# EAGLE design mux-shield-pcb (EAGLE 7.3.0)
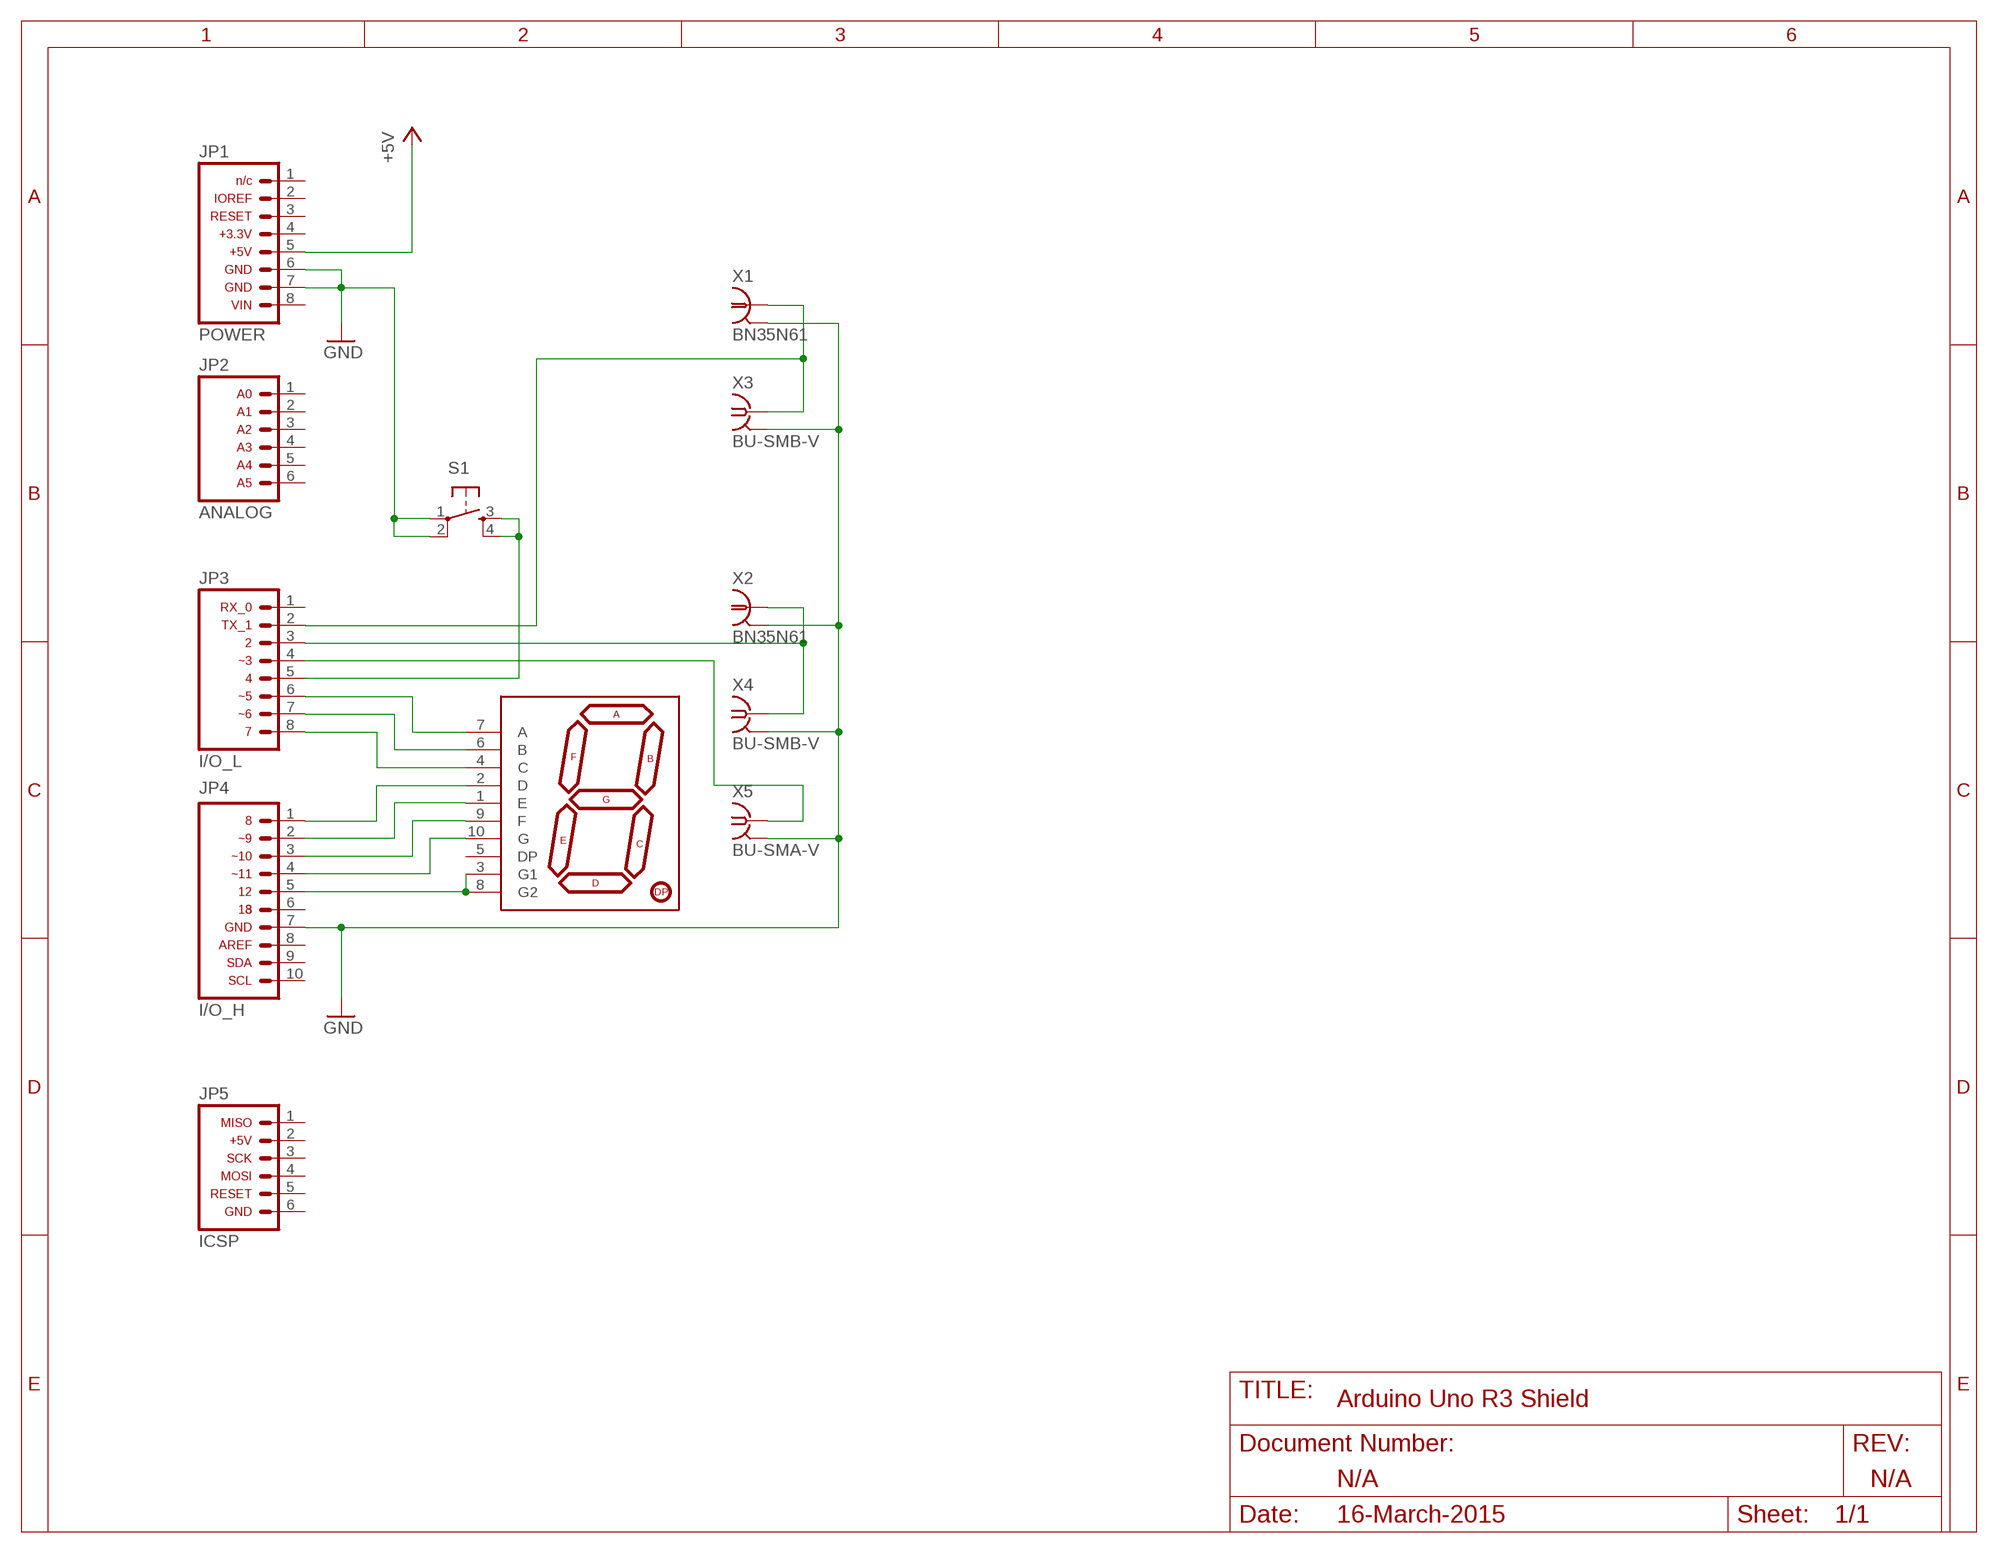
[diagram p0: schematic, sheet 1]

## Parts
JP1  ARDUINO_CONN-POWERSIP  [CONN-1X08]
JP2  ARDUINO_CONN-ANALOGSIP  [CONN-1X06]
JP3  ARDUINO_CONN-IO_LSIP  [CONN-1X08]
JP4  ARDUINO_CONN-IO_HSIP  [CONN-1X10]
JP5  ARDUINO_CONN-ICSP  [CONN-2X03]
S1  TAC_SWITCHPTH  [TACTILE-PTH]
U$1  7-SEGMENT-DISPLAY-1"-RED  [7-SEGMENT-1"PTH]
X1  BN35N61  [B35N61]
X2  BN35N61  [B35N61]
X3  BU-SMB-V  [BU-SMB-V]
X4  BU-SMB-V  [BU-SMB-V]
X5  BU-SMA-V  [BU-SMA-V]

## Nets
+5V: JP1.5
GND: JP1.6 JP1.7 JP4.7 S1.1 S1.2 X1.2 X1.3 X1.4 X1.5 X2.2 X2.3 X2.4 X2.5 X3.2 X3.3 X3.4 X3.5 X4.2 X4.3 X4.4 X4.5 X5.2 X5.3 X5.4 X5.5
N$1: JP3.2 X1.1 X3.1
N$2: JP3.4 X5.1
N$3: JP3.3 X2.1 X4.1
N$4: JP3.5 S1.3 S1.4
N$5: JP4.5 U$1.3(G1) U$1.8(G2)
N$6: JP3.6 U$1.7(A)
N$7: JP3.7 U$1.6(B)
N$8: JP3.8 U$1.4(C)
N$9: JP4.1 U$1.2(D)
N$10: JP4.2 U$1.1(E)
N$11: JP4.3 U$1.9(F)
N$12: JP4.4 U$1.10(G)
Unconnected: JP1.1 JP1.2 JP1.3 JP1.4 JP1.8 JP2.1 JP2.2 JP2.3 JP2.4 JP2.5 JP2.6 JP3.1 JP4.6 JP4.8 JP4.9 JP4.10 JP5.1 JP5.2 JP5.3 JP5.4 JP5.5 JP5.6 U$1.5(DP)

## Library data of the parts
JP1 = _Jim:ARDUINO_CONN-POWER: Arduino Power Header
JP2 = _Jim:ARDUINO_CONN-ANALOG: Arduino Analog I/O Header
JP3 = _Jim:ARDUINO_CONN-IO_L: Arduino Digital I/O [Low Byte] Header
JP4 = _Jim:ARDUINO_CONN-IO_H: Arduino Digital I/O [High Byte] Header
JP5 = _Jim:ARDUINO_CONN-ICSP: Header 6
S1 = SparkFun-Retired:TAC_SWITCH: Momentary Switch Button commonly used for reset or general input. Spark Fun Electronics SKU : COM-00097 SMT- SWCH-08247
U$1 = SparkFun-Displays:7-SEGMENT-DISPLAY-1"-RED: 7-Segment Display 1" Red (COM-08546) EZ is for kits. Pads are only exposed on the bottom side to help prevent soldering in upside down.
X1 X2 = con-coax:BN35N61: BNC CONNECTOR M/A COM www.macom.com distributor Farnell 149-452; OC_FARNELL: unknown; OC_NEWARK: unknown
X3 X4 = con-coax:BU-SMB-V: FEMALE SMB CONNECTOR Radiall distributor RS 112-2993; OC_FARNELL: unknown; OC_NEWARK: unknown
X5 = con-coax:BU-SMA-V: FEMALE SMA CONNECTOR Radiall distributor RS 112-3794; OC_FARNELL: unknown; OC_NEWARK: unknown

## Board
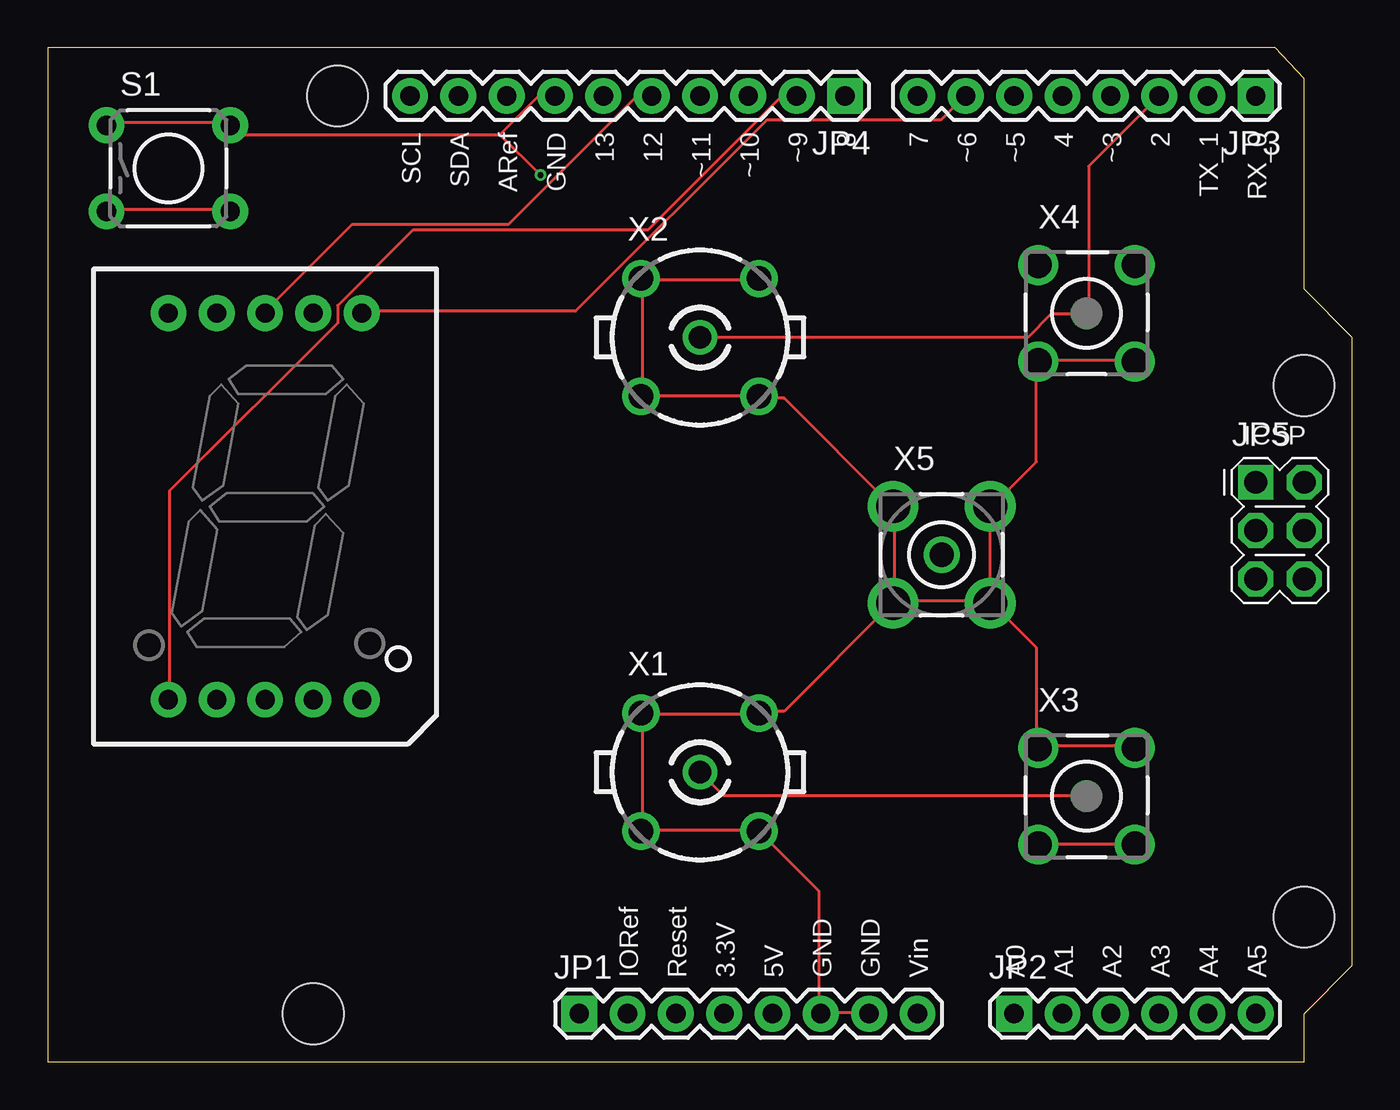
[diagram p1: board, top side]
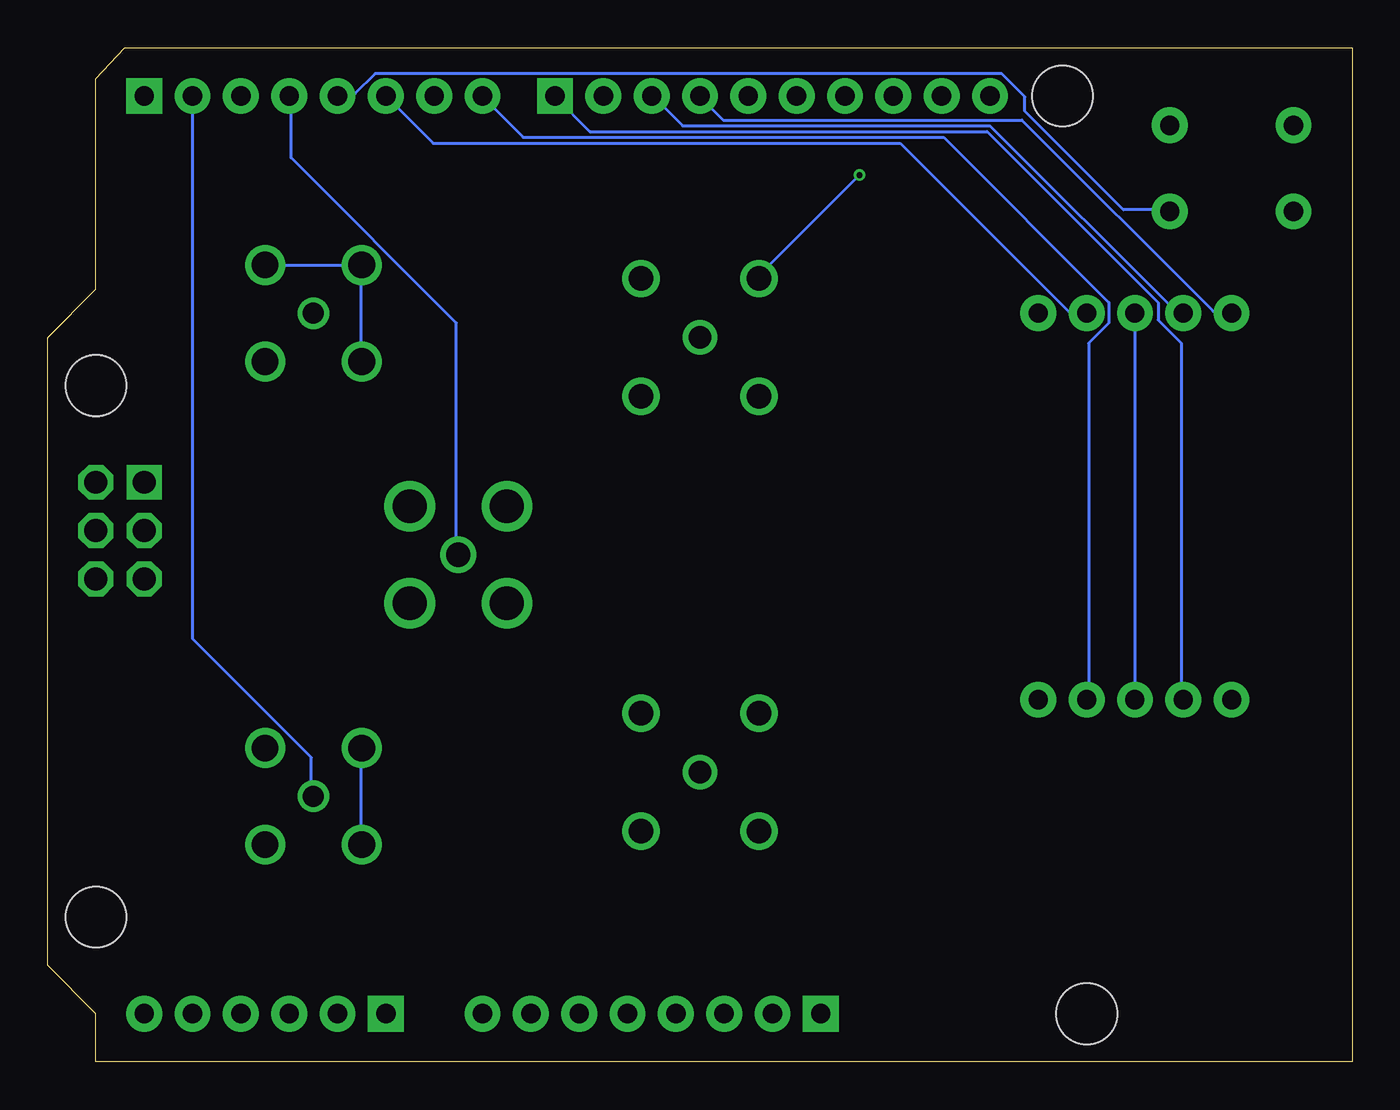
[diagram p2: board, bottom side, seen from below]

Size 68.58 x 53.34 mm. Coordinates in mm from the lower left corner, seen from the top.
Outline: 0,0 66.04,0 66.04,2.54 68.58,5.08 68.58,38.1 66.04,40.64 66.04,51.69 64.52,53.34 0,53.34 0,0
Copper layers (1*16): Top 0.035mm / dielectric 1.5mm / Bottom 0.035mm
Design rules "SeeedStudio_2layer_DRU_no_angle_20140221": minimum track width 6mil, minimum drill 12mil, track to track 6mil, track to pad 6mil, pad to pad 6mil, via to via 6mil, smd to smd 0mil, copper to edge 10mil, drill to drill 10mil, minimum pad ring 10mil, minimum via ring 6mil, stop-mask expansion 2mil, vias tented up to drill 100mil, thermal gap 10mil
Holes 3.2 mm at 15.24,50.8 66.04,35.56 66.04,7.62 13.97,2.54

### Footprints (pad centres in the part's own frame; a part is rotated, then mirrored left to right if it is on the bottom)
CONN-1X08 = drill 1.016 pad 1.88 square: 1 0,0 | drill 1.016 pad 1.88: 2 2.54,0; 3 5.08,0; 4 7.62,0; 5 10.16,0; 6 12.7,0; 7 15.24,0; 8 17.78,0
CONN-1X06 = drill 1.016 pad 1.88 square: 1 0,0 | drill 1.016 pad 1.88: 2 2.54,0; 3 5.08,0; 4 7.62,0; 5 10.16,0; 6 12.7,0
CONN-1X10 = drill 1.016 pad 1.88 square: 1 0,0 | drill 1.016 pad 1.88: 2 2.54,0; 3 5.08,0; 4 7.62,0; 5 10.16,0; 6 12.7,0; 7 15.24,0; 8 17.78,0; 9 20.32,0; 10 22.86,0
CONN-2X03 = drill 1.2 pad 1.829 square: 1 0,0 | drill 1.2 pad 1.829 octagon: 2 2.54,0; 3 0,-2.54; 4 2.54,-2.54; 5 0,-5.08; 6 2.54,-5.08
TACTILE-PTH = drill 1.016 pad 1.88: 1 -3.251,2.261; 2 3.251,2.261; 3 -3.251,-2.261; 4 3.251,-2.261
7-SEGMENT-1"PTH = drill 1 pad 1.88: 1 -5.08,-10.16; 2 -2.54,-10.16; 3 0,-10.16; 4 2.54,-10.16; 5 5.08,-10.16; 6 5.08,10.16; 7 2.54,10.16; 8 0,10.16; 9 -2.54,10.16; 10 -5.08,10.16
B35N61 = drill 1.2: 1 0,0 | drill 1.3: 2 3.099,3.099; 3 -3.099,3.099; 4 -3.099,-3.099; 5 3.099,-3.099
BU-SMB-V = drill 1.1: 1 0,0 | drill 1.4: 2 -2.54,2.54; 3 2.54,2.54; 4 2.54,-2.54; 5 -2.54,-2.54
BU-SMA-V = drill 1.27: 1 0,0 | drill 1.778: 2 -2.55,2.55; 3 2.55,2.55; 4 2.55,-2.55; 5 -2.55,-2.55

### Placement (x,y rotation side)
JP1  27.94,2.54 0 top
JP2  50.8,2.54 0 top
JP3  63.5,50.8 180 top
JP4  41.91,50.8 180 top
JP5  63.5,30.48 0 top
S1  6.35,46.99 0 top
U$1  11.43,29.21 0 top
X1  34.29,15.24 0 top
X2  34.29,38.1 0 top
X3  54.61,13.97 0 top
X4  54.61,39.37 0 top
X5  46.99,26.67 0 top

### Tracks (layer width: path | path; a pad name or v marks a point on that pad's centre or on a via)
GND  (via drill 0.3)
  Top 0.152: JP1.7 43.13,2.59 40.69,2.59 JP1.6 40.54,2.59 40.54,8.99 X1.5 37.34,12.19 31.24,12.19 | 31.24,18.29 31.24,12.19 | 31.24,12.19 X1.4 | 31.24,18.29 37.34,18.29 X1.2 37.49,18.44 38.71,18.44 44.35,24.08 X5.5 44.5,24.23 | 31.24,18.29 X1.3 | S1.1 3.2,49.38 9.6,49.38 S1.2 9.6,49.23 10.06,48.77 23.77,48.77 | 23.77,48.77 25.76,50.75 26.67,50.75 JP4.7 | 31.24,41.15 31.24,35.05 | 31.24,35.05 37.34,35.05 X2.5 37.49,34.9 38.71,34.9 44.35,29.26 X5.2 44.5,29.11 44.5,24.23 | 31.24,35.05 X2.4 | 31.24,41.15 37.34,41.15 X2.2 | 31.24,41.15 X2.3 | X4.4 57.15,36.88 52.12,36.88 X4.5 51.97,36.73 51.97,31.55 49.68,29.26 X5.3 49.53,29.11 49.53,24.23 | X3.4 X3.5 | X3.3 57.15,16.61 52.12,16.61 X3.2 51.97,16.61 51.97,21.79 49.68,24.08 X5.4 49.53,24.23 | 49.53,24.23 44.5,24.23 | v25.91,46.63 23.77,48.77
  Bottom 0.152: X4.3 52.12,41.91 | 52.12,41.91 52.12,36.88 X4.5 | 52.12,41.91 X4.2 | X3.5 52.12,11.43 52.12,16.46 X3.2 | v25.91,46.63 31.24,41.3 X2.3
N$1
  Top 0.152: X1.1 35.51,14.02 54.56,14.02 X3.1
  Bottom 0.152: JP3.2 60.96,22.25 54.71,16 54.71,14.02 X3.1
N$2
  Bottom 0.152: JP3.4 55.78,50.75 55.78,47.55 47.09,38.86 47.09,26.67 X5.1
N$3
  Top 0.152: JP3.3 54.71,47.09 54.71,39.47 X4.1 54.56,39.32 52.73,39.32 51.51,38.1 X2.1
N$4
  Top 0.152: S1.3 3.2,44.81 9.6,44.81 S1.4
  Bottom 0.152: JP3.5 53.34,50.9 52.43,50.9 51.36,51.97 18.44,51.97 17.22,50.75 17.22,49.99 12.04,44.81 9.6,44.81 S1.4
N$5
  Top 0.152: JP4.5 31.7,50.75 30.94,50.75 24.23,44.04 16,44.04 11.43,39.47 U$1.8
  Bottom 0.152: U$1.8 U$1.3
N$6
  Bottom 0.152: JP3.6 48.31,48.31 23.77,48.31 14.94,39.47 14.02,39.47 U$1.7
N$7
  Top 0.152: U$1.6 16.61,39.47 27.74,39.47 37.8,49.53 46.94,49.53 48.16,50.75 JP3.7
N$8
  Bottom 0.152: U$1.4 13.87,19.05 13.87,37.8 12.8,38.86 12.8,39.93 21.49,48.62 43.59,48.62 45.72,50.75 JP3.8
N$9
  Bottom 0.152: U$1.2 8.99,19.05 8.99,37.8 10.21,39.01 10.21,39.93 19.2,48.92 40.08,48.92 41.91,50.75 JP4.1
N$10
  Top 0.152: U$1.1 6.4,19.05 6.4,30.02 15.24,38.86 15.24,39.78 19.2,43.74 31.55,43.74 38.56,50.75 39.32,50.75 JP4.2
N$11
  Bottom 0.152: U$1.9 8.99,39.47 9.3,39.47 19.05,49.23 35.2,49.23 36.73,50.75 JP4.3
N$12
  Bottom 0.152: U$1.10 6.4,39.47 7.32,39.47 17.37,49.53 33.07,49.53 34.29,50.75 JP4.4

### Text on the board
tPlace: SCL | SDA | ARef | GND | 13 | 12 | ~11 | ~10 | ~9 | 8 | 7 | ~6 | ~5 | 4 | ~3 | 2 | TX_1 | RX_0 | ICSP | IORef | Reset | 3.3V | 5V | GND | GND | Vin | A0 | A1 | A2 | A3 | A4 | A5
tDocu: Line | Mux | Frame | 1: Detector 1 / 2: Detector 2 / 3: Interleaved | v1.1